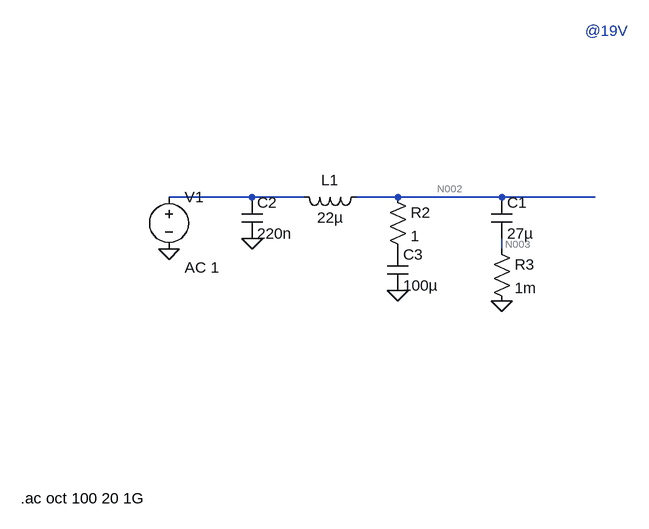
[diagram p0: schematic 3V3BuckInputFilter.asc]
3V3BuckInputFilter.asc, the LTspice schematic file:
Version 4
SHEET 1 880 680
WIRE -464 48 -592 48
WIRE -384 48 -464 48
WIRE -240 48 -304 48
WIRE -80 48 -240 48
WIRE 64 48 -80 48
WIRE -80 128 -80 112
FLAG -240 192 0
FLAG -80 208 0
FLAG -464 112 0
FLAG -592 128 0
SYMBOL cap -96 48 R0
SYMATTR InstName C1
SYMATTR Value 27µ
SYMBOL ind -288 32 R90
WINDOW 0 5 56 VBottom 2
WINDOW 3 32 56 VTop 2
SYMATTR InstName L1
SYMATTR Value 22µ
SYMATTR SpiceLine Ipk=2 Rser=100m
SYMBOL res -256 32 R0
SYMATTR InstName R2
SYMATTR Value 1
SYMBOL cap -256 128 R0
SYMATTR InstName C3
SYMATTR Value 100µ
SYMBOL res -96 112 R0
SYMATTR InstName R3
SYMATTR Value 1m
SYMBOL cap -480 48 R0
SYMATTR InstName C2
SYMATTR Value 220n
SYMBOL voltage -592 32 R0
WINDOW 123 24 124 Left 2
WINDOW 39 0 0 Left 0
SYMATTR InstName V1
SYMATTR Value ""
SYMATTR Value2 AC 1
TEXT 48 -208 Left 2 ;@19V
TEXT -820 512 Left 2 !.ac oct 100 20 1G

The netlist it stands for:
* 3V3BuckInputFilter.asc
C1 N002 N003 27µ
L1 N002 N001 22µ Ipk=2 Rser=100m
R2 N002 P001 1
C3 P001 0 100µ
R3 N003 0 1m
C2 N001 0 220n
V1 N001 0 AC 1
* @19V
.ac oct 100 20 1G
.backanno
.end

* Results of the author's LTspice run, read from the files saved beside the schematic
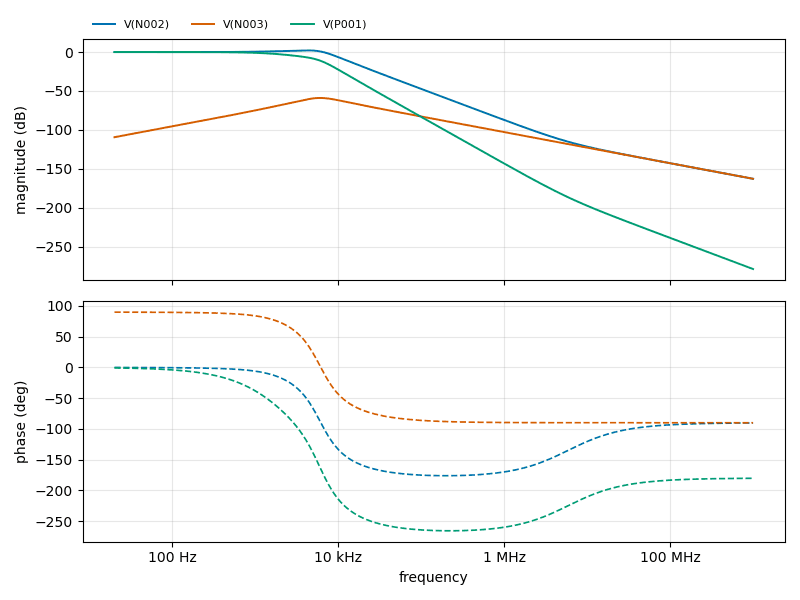
[diagram p1: AC Analysis of 3V3BuckInputFilter.asc, plotted from the saved traces]
* AC Analysis, 1 run:
*   V(N002): 0.00 dB at 20 Hz, -162.82 dB at 1 GHz, peak 2.17 dB at 4.159 kHz, 3 dB below the peak at 7.033 kHz
*   V(N003): -109.39 dB at 20 Hz, -162.82 dB at 1 GHz, peak -58.96 dB at 6.047 kHz, 3 dB below the peak at 3.687 kHz and 10.03 kHz
*   V(P001): -0.00 dB at 20 Hz, -278.78 dB at 1 GHz, peak -0.00 dB at 20 Hz, 3 dB below the peak at 2.054 kHz